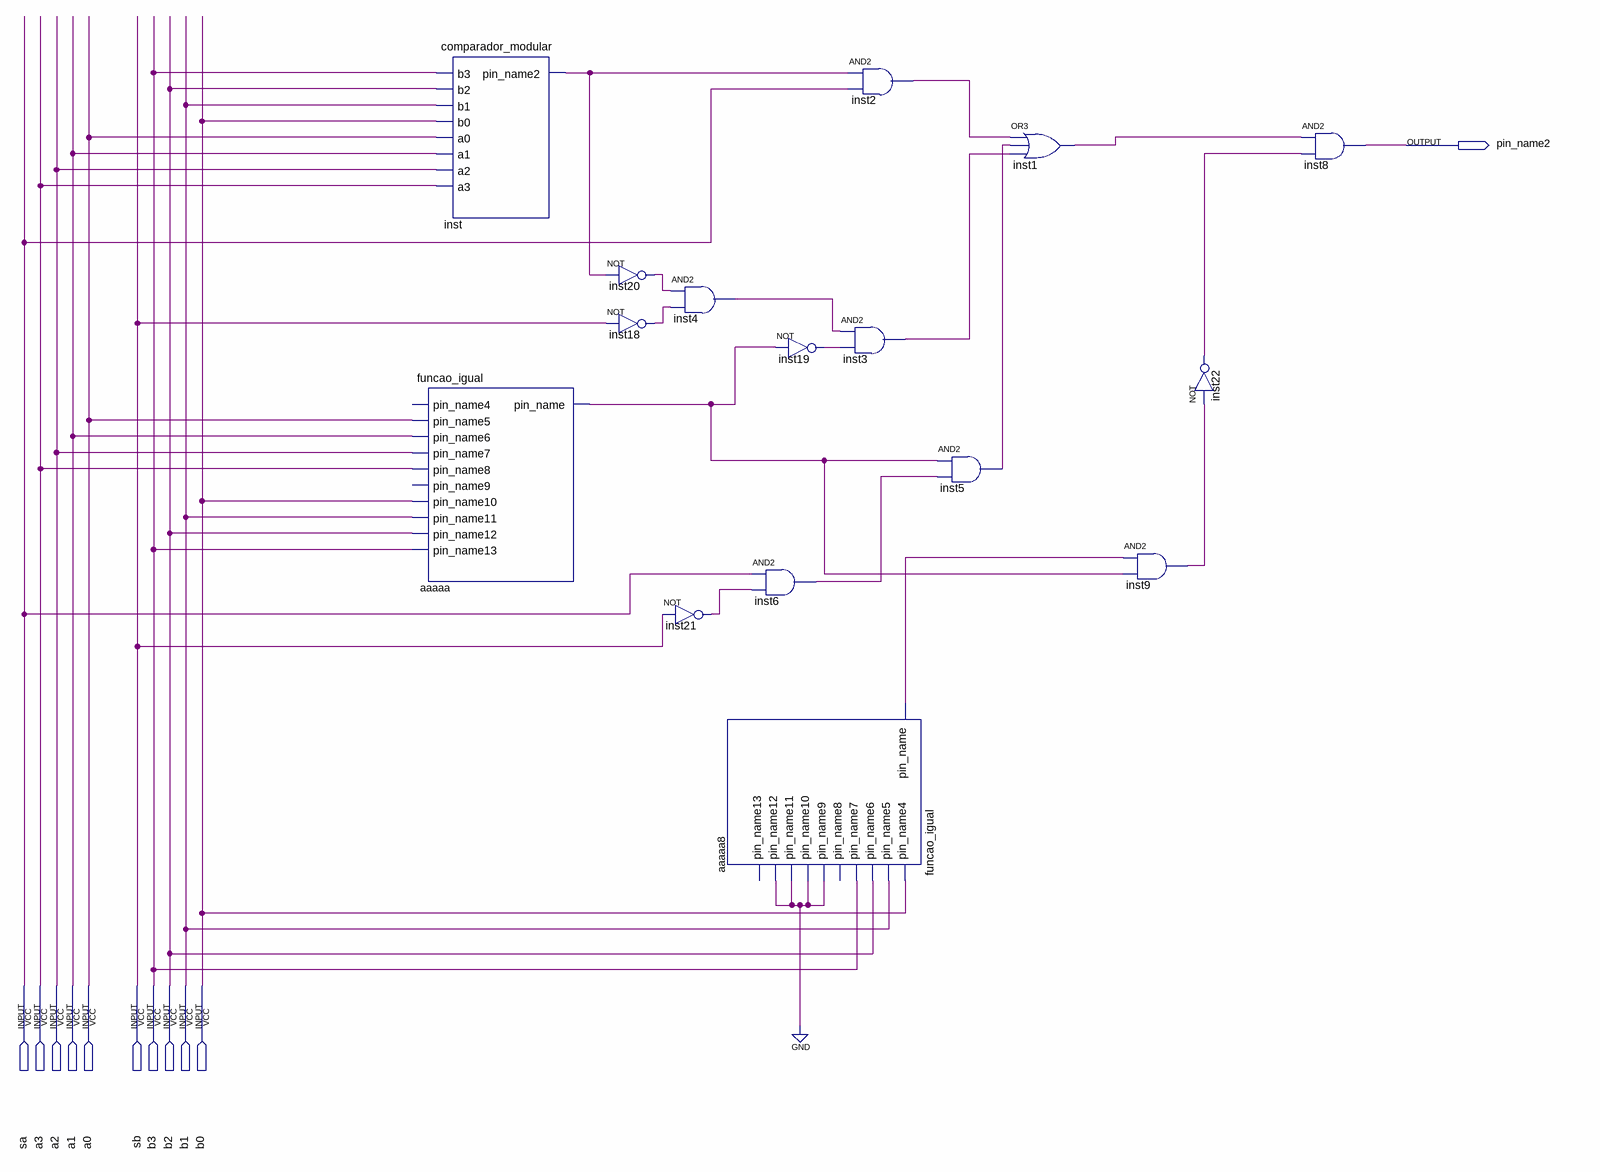
[diagram p0: schematic sheet]
// Quartus schematic maiorque.bdf as structural Verilog: 16 symbols, 11 pins
module maiorque (
  input  sa,
  input  a3,
  input  a2,
  input  a1,
  input  a0,
  input  sb,
  input  b3,
  input  b2,
  input  b1,
  input  b0,
  output pin_name2
);

  wire aaaaa8_pin_name, aaaaa_pin_name, inst1_out, inst2_out, inst3_out, inst4_out, inst5_out, inst6_out,
       inst9_out, inst18_out, inst19_out, inst20_out, inst21_out, inst22_out, inst_pin_name2;

  comparador_modular inst (
    .b3(b3), .b2(b2), .b1(b1), .b0(b0), .a0(a0), .a1(a1), .a2(a2), .a3(a3), .pin_name2(inst_pin_name2));
  funcao_igual aaaaa (
    .pin_name5(a0), .pin_name6(a1), .pin_name7(a2), .pin_name8(a3), .pin_name10(b0), .pin_name11(b1),
    .pin_name12(b2), .pin_name13(b3), .pin_name(aaaaa_pin_name));  // open: pin_name4, pin_name9
  not inst20 (inst20_out, inst_pin_name2);
  not inst18 (inst18_out, sb);
  and inst4 (inst4_out, inst20_out, inst18_out);
  not inst21 (inst21_out, sb);
  funcao_igual aaaaa8 (
    .pin_name4(b0), .pin_name5(b1), .pin_name6(b2), .pin_name7(b3), .pin_name9(1'b0), .pin_name10(1'b0),
    .pin_name11(1'b0), .pin_name12(1'b0), .pin_name(aaaaa8_pin_name));  // open: pin_name8, pin_name13
  not inst19 (inst19_out, aaaaa_pin_name);
  and inst6 (inst6_out, sa, inst21_out);
  and inst2 (inst2_out, inst_pin_name2, sa);
  and inst3 (inst3_out, inst4_out, inst19_out);
  and inst5 (inst5_out, aaaaa_pin_name, inst6_out);
  or inst1 (inst1_out, inst2_out, inst5_out, inst3_out);
  and inst9 (inst9_out, aaaaa8_pin_name, aaaaa_pin_name);
  not inst22 (inst22_out, inst9_out);
  and inst8 (pin_name2, inst1_out, inst22_out);
endmodule
